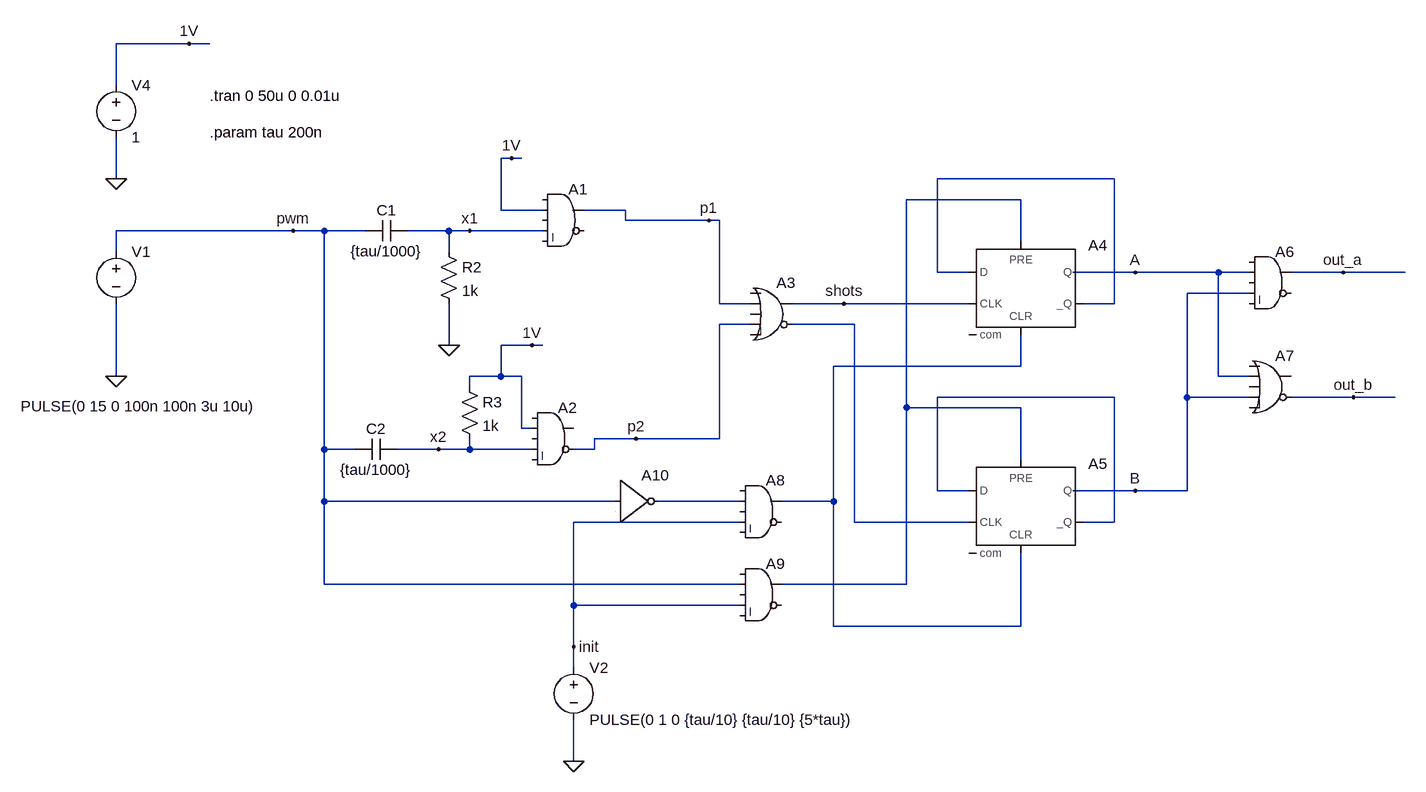
[diagram p0: schematic Driver HB with deadtime - design.asc]
Driver HB with deadtime - design.asc, the LTspice schematic file:
Version 4
SHEET 1 1872 1636
WIRE -512 448 -624 448
WIRE -480 448 -512 448
WIRE -624 512 -624 448
WIRE -16 624 -32 624
WIRE 0 624 -16 624
WIRE -624 656 -624 592
WIRE 912 656 640 656
WIRE 768 688 592 688
WIRE -32 704 -32 624
WIRE 32 704 -32 704
WIRE 160 704 96 704
WIRE 160 720 160 704
WIRE 288 720 160 720
WIRE 304 720 288 720
WIRE -352 736 -624 736
WIRE -304 736 -352 736
WIRE -240 736 -304 736
WIRE -112 736 -176 736
WIRE -80 736 -112 736
WIRE 32 736 -80 736
WIRE 768 752 768 688
WIRE -624 768 -624 736
WIRE -112 768 -112 736
WIRE 640 800 640 656
WIRE 688 800 640 800
WIRE 944 800 848 800
WIRE 1072 800 944 800
WIRE 1120 800 1072 800
WIRE 1264 800 1184 800
WIRE 1360 800 1264 800
WIRE 1120 832 1024 832
WIRE 304 848 304 720
WIRE 352 848 304 848
WIRE 496 848 416 848
WIRE 688 848 496 848
WIRE 912 848 912 656
WIRE 912 848 864 848
WIRE 352 880 304 880
WIRE 512 880 416 880
WIRE -112 912 -112 848
WIRE 16 912 -32 912
WIRE 32 912 16 912
WIRE 768 944 768 896
WIRE 768 944 480 944
WIRE -624 960 -624 848
WIRE -32 960 -32 912
WIRE -32 960 -80 960
WIRE 0 960 -32 960
WIRE 1072 960 1072 800
WIRE 1120 960 1072 960
WIRE -80 976 -80 960
WIRE 912 992 640 992
WIRE 1024 992 1024 832
WIRE 1120 992 1024 992
WIRE 1280 992 1184 992
WIRE 1344 992 1280 992
WIRE 592 1008 592 688
WIRE 768 1008 592 1008
WIRE 0 1040 0 960
WIRE 16 1040 0 1040
WIRE 176 1056 112 1056
WIRE 304 1056 304 880
WIRE 304 1056 176 1056
WIRE -304 1072 -304 736
WIRE -256 1072 -304 1072
WIRE -128 1072 -192 1072
WIRE -80 1072 -80 1056
WIRE -80 1072 -128 1072
WIRE 16 1072 -80 1072
WIRE 112 1072 112 1056
WIRE 112 1072 80 1072
WIRE 768 1088 768 1008
WIRE 640 1136 640 992
WIRE 688 1136 640 1136
WIRE 944 1136 848 1136
WIRE 1024 1136 1024 992
WIRE 1024 1136 944 1136
WIRE -304 1152 -304 1072
WIRE 144 1152 -304 1152
WIRE 336 1152 208 1152
WIRE 480 1152 480 944
WIRE 480 1152 400 1152
WIRE 336 1184 80 1184
WIRE 512 1184 512 880
WIRE 688 1184 512 1184
WIRE 912 1184 912 992
WIRE 912 1184 864 1184
WIRE -304 1280 -304 1152
WIRE 336 1280 -304 1280
WIRE 592 1280 592 1008
WIRE 592 1280 400 1280
WIRE 80 1312 80 1184
WIRE 336 1312 80 1312
WIRE 480 1344 480 1152
WIRE 768 1344 768 1232
WIRE 768 1344 480 1344
WIRE 80 1376 80 1312
WIRE 80 1408 80 1376
WIRE 80 1552 80 1488
FLAG -16 624 1V
FLAG -112 912 0
FLAG 288 720 p1
FLAG 176 1056 p2
FLAG 16 912 1V
FLAG -352 736 pwm
FLAG -80 736 x1
FLAG -128 1072 x2
FLAG -624 656 0
FLAG -512 448 1V
FLAG 496 848 shots
FLAG 944 800 A
FLAG 1264 800 out_a
FLAG 1280 992 out_b
FLAG -624 960 0
FLAG 944 1136 B
FLAG 80 1552 0
FLAG 80 1376 init
SYMBOL cap -176 720 R90
WINDOW 0 0 32 VBottom 2
WINDOW 3 32 32 VTop 2
SYMATTR InstName C1
SYMATTR Value {tau/1000}
SYMBOL res -128 752 R0
SYMATTR InstName R2
SYMATTR Value 1k
SYMBOL res -96 960 R0
SYMATTR InstName R3
SYMATTR Value 1k
SYMBOL cap -192 1056 R90
WINDOW 0 0 32 VBottom 2
WINDOW 3 32 32 VTop 2
SYMATTR InstName C2
SYMATTR Value {tau/1000}
SYMBOL Digital\\and 64 656 R0
SYMATTR InstName A1
SYMBOL Digital\\and 48 992 R0
SYMATTR InstName A2
SYMBOL voltage -624 496 R0
WINDOW 123 0 0 Left 0
WINDOW 39 0 0 Left 0
SYMATTR InstName V4
SYMATTR Value 1
SYMBOL Digital\\or 384 800 R0
SYMATTR InstName A3
SYMBOL Digital\\dflop 768 752 R0
SYMATTR InstName A4
SYMBOL Digital\\dflop 768 1088 R0
SYMATTR InstName A5
SYMBOL Digital\\and 1152 752 R0
SYMATTR InstName A6
SYMBOL Digital\\or 1152 912 R0
SYMATTR InstName A7
SYMBOL voltage -624 752 R0
WINDOW 3 -147 254 Left 2
WINDOW 123 0 0 Left 0
WINDOW 39 0 0 Left 0
SYMATTR Value PULSE(0 15 0 100n 100n 3u 10u)
SYMATTR InstName V1
SYMBOL voltage 80 1392 R0
WINDOW 123 0 0 Left 0
WINDOW 39 0 0 Left 0
SYMATTR InstName V2
SYMATTR Value PULSE(0 1 0 {tau/10} {tau/10} {5*tau})
SYMBOL Digital\\and 368 1104 R0
SYMATTR InstName A8
SYMBOL Digital\\and 368 1232 R0
SYMATTR InstName A9
SYMBOL Digital\\inv 144 1088 R0
SYMATTR InstName A10
TEXT -480 528 Left 2 !.tran 0 50u 0 0.01u
TEXT -480 584 Left 2 !.param tau 200n

The netlist it stands for:
* Driver HB with deadtime - design.asc
C1 x1 pwm {tau/1000}
R2 x1 0 1k
R3 1V x2 1k
C2 x2 pwm {tau/1000}
A1 0 1V 0 x1 0 0 p1 0 AND
A2 0 1V 0 x2 0 p2 0 0 AND
V4 1V 0 1
A3 0 p1 0 p2 0 N003 shots 0 OR
A4 N001 0 shots N002 N004 N001 A 0 DFLOP
A5 N005 0 N003 N002 N004 N005 B 0 DFLOP
A6 0 A 0 B 0 0 out_a 0 AND
A7 0 A 0 B 0 out_b 0 0 OR
V1 pwm 0 PULSE(0 15 0 100n 100n 3u 10u)
V2 init 0 PULSE(0 1 0 {tau/10} {tau/10} {5*tau})
A8 0 N006 0 init 0 0 N004 0 AND
A9 0 pwm 0 init 0 0 N002 0 AND
A10 pwm 0 0 0 0 N006 0 0 BUF
.tran 0 50u 0 0.01u
.param tau 200n
.backanno
.end